# EAGLE design PDB (EAGLE 9.5.2)
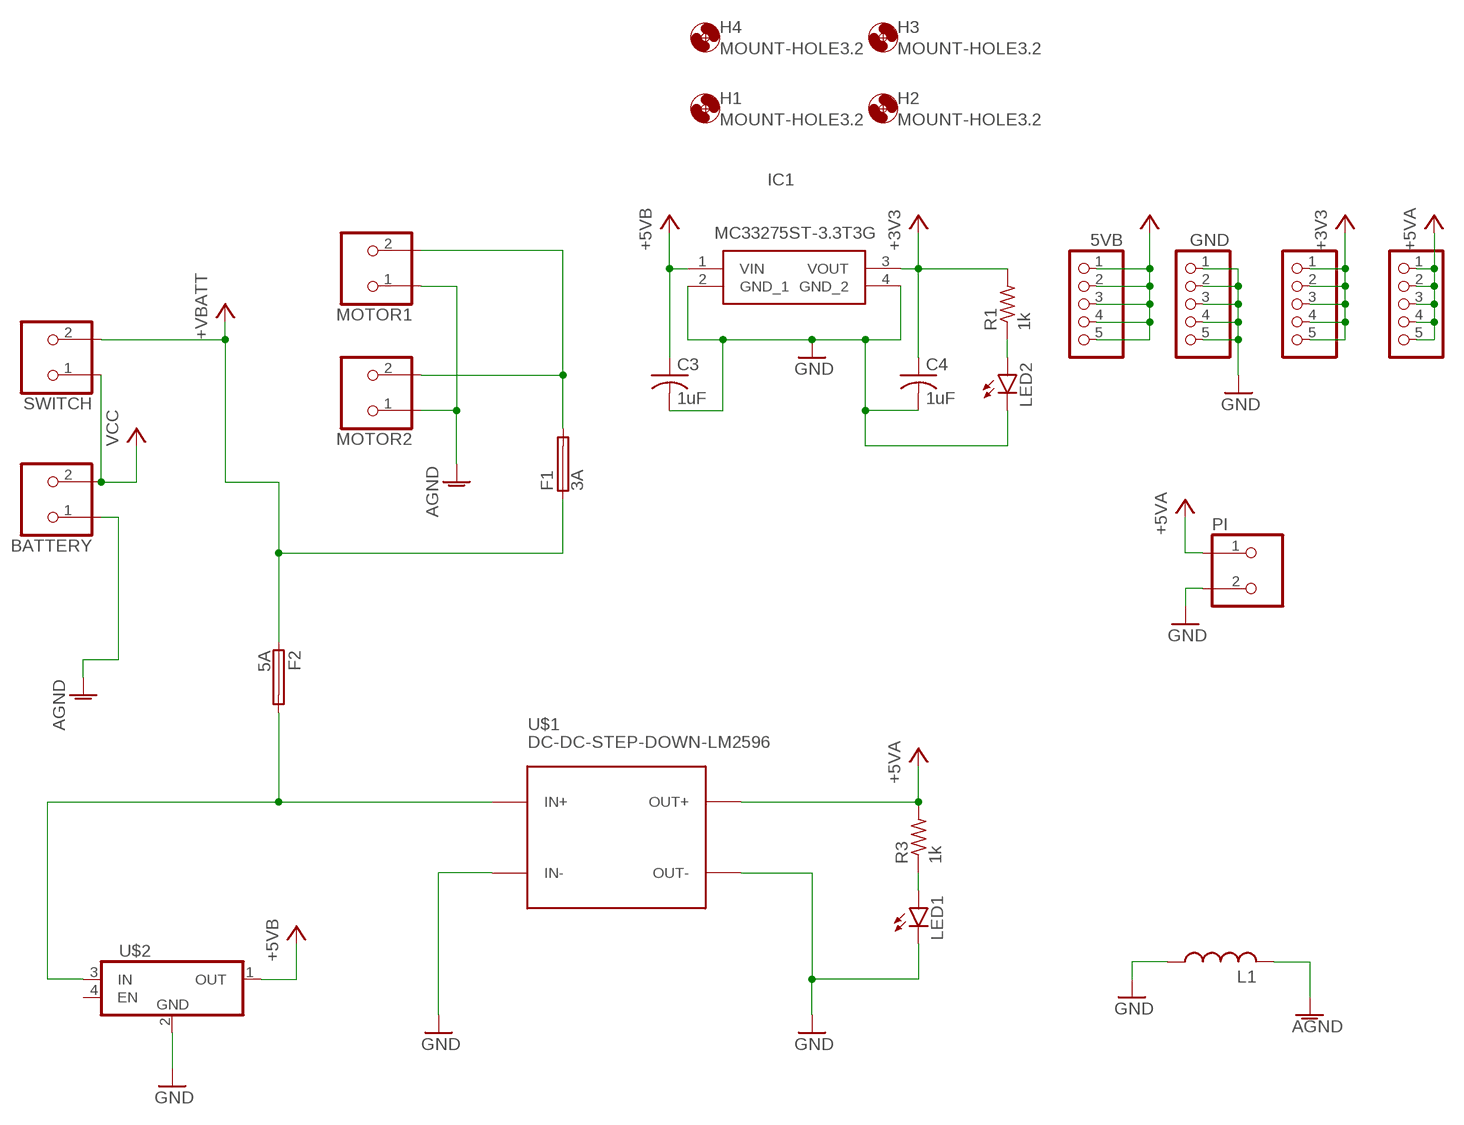
[diagram p0: schematic, sheet 1]

## Parts
3V3  PINHD-1X5  [1X05]
5VA  PINHD-1X5  [1X05]
5VB  PINHD-1X5  [1X05]
BATTERY  TERMINAL_2PINS  [TERMINAL_1X2]
C3  1uF  C-USC0805  [C0805]
C4  1uF  C-USC0805  [C0805]
F1  3A  SH22,5A  [SH22,5A]
F2  5A  SH22,5A  [SH22,5A]
GND  PINHD-1X5  [1X05]
H1  MOUNT-HOLE3.2  [3,2]
H2  MOUNT-HOLE3.2  [3,2]
H3  MOUNT-HOLE3.2  [3,2]
H4  MOUNT-HOLE3.2  [3,2]
IC1  MC33275ST-3.3T3G  [SOT230P700X175-4N]
L1  L-USL1812  [L1812]
LED1  LED5MM  [LED5MM]
LED2  LED5MM  [LED5MM]
MOTOR1  TERMINAL_2PINS  [TERMINAL_1X2]
MOTOR2  TERMINAL_2PINS  [TERMINAL_1X2]
PI  TERMINAL_2PINS  [TERMINAL_1X2]
R1  1k  R-US_R0805  [R0805]
R3  1k  R-US_R0805  [R0805]
SWITCH  TERMINAL_2PINS  [TERMINAL_1X2]
U$1  DC-DC-STEP-DOWN-LM2596  [DC-DC-STEP-DOWN-LM2596]
U$2  DC-DC-STEP-DOWN-MP2315  [DC-DC-STEP-DOWN-MP2315]

## Nets
+3V3: 3V3.1 3V3.2 3V3.3 3V3.4 3V3.5 C4.1 IC1.3(VOUT) R1.2
+5VA: 5VA.1 5VA.2 5VA.3 5VA.4 5VA.5 PI.1 R3.2 U$1.OUT+
+5VB: 5VB.1 5VB.2 5VB.3 5VB.4 5VB.5 C3.1 IC1.1(VIN) U$2.1(OUT)
+VBATT: F1.1 F2.1 SWITCH.2
AGND: BATTERY.1 L1.2 MOTOR1.1 MOTOR2.1
GND: C3.2 C4.2 GND.1 GND.2 GND.3 GND.4 GND.5 IC1.2(GND_1) IC1.4(GND_2) L1.1 LED1.K(C) LED2.K(C) PI.2 U$1.IN- U$1.OUT- U$2.2(GND)
N$5: F1.2 MOTOR1.2 MOTOR2.2
N$11: LED2.A R1.1
N$12: LED1.A R3.1
VCC: BATTERY.2 SWITCH.1
VFUSE1: F2.2 U$1.IN+ U$2.3(IN)
Unconnected: U$2.4(EN)

## Library data of the parts
3V3 5VA 5VB GND = pinhead:PINHD-1X5: PIN HEADER
BATTERY MOTOR1 MOTOR2 PI SWITCH = sep150:TERMINAL_2PINS
C3 C4 = rcl:C-US: CAPACITOR, American symbol; SPICEPREFIX: C
F1 F2 = sep150:SH22,5A: FUSE HOLDER grid 22,5mm, isolated cap OGN0031 8201, Schurter (Buerklin); MPN: 0031.7701.11; OC_FARNELL: unknown; OC_NEWARK: 04F1224
H1-H4 = holes:MOUNT-HOLE: MOUNTING HOLE with drill center marker
IC1 = MC33275ST-3.3T3G:MC33275ST-3.3T3G: LDO Regulator 3.3V 1% 300mA SOT223 ON Semiconductor MC33275ST-3.3T3G, LDO Voltage Regulator, 300mA, 3.3 V, Maximum of 13 Vin, 3 + Tab-Pin SOT-223 Source: Datasheet <https://componentsearchengine.com/Datasheets/1/MC33275ST-3.3T3G.pdf>; DESCRIPTION: LDO Regulator 3.3V 1% 300mA SOT223 ON Semiconductor MC33275ST-3.3T3G, LDO Voltage Regulator, 300mA, 3.3 V, Maximum of 13 Vin, 3 + Tab-Pin SOT-223; HEIGHT: 1.75mm; MANUFACTURER_NAME: ON Semiconductor; MANUFACTURER_PART_NUMBER: MC33275ST-3.3T3G; MOUSER_PART_NUMBER: 863-MC33275ST-3.3T3G; MOUSER_PRICE-STOCK: https://www.mouser.com/Search/Refine.aspx?Keyword=863-MC33275ST-3.3T3G
L1 = rcl:L-US: INDUCTOR, American symbol; SPICEPREFIX: L
LED1 LED2 = led:LED: LED OSRAM: - CHIPLED LG R971, LG N971, LY N971, LG Q971, LY Q971, LO R971, LY R971 LH N974, LH R974 LS Q976, LO Q976, LY Q976 LO Q996 - Hyper CHIPLED LW Q18S LB Q993, LB Q99A, LB R99A - SideLED LS A670, LO A670, LY A670, LG A670, LP A670 LB A673, LV A673, LT A673, LW A673 LH A674 LY A675 LS A676, LA A676, LO A676, LY A676, LW A676 LS A679, LY A679, LG A679 - Hyper Micro SIDELED® LS Y876, LA Y876, LO Y876, LY Y876 LT Y87S - SmartLED LW L88C, LW L88S LB L89C, LB L89S, LG L890 LS L89K, LO L89K, LY L89K LS L896, LA L896, LO L896, LY L896 - TOPLED LS T670, LO T670, LY T670, LG T670, LP T670 LSG T670, LSP T670, LSY T670, LOP T670, LYG T670 LG T671, LOG T671, LSG T671 LB T673, LV T673, LT T673, LW T673 LH T674 LS T676, LA T676, LO T676, LY T676, LB T676, LH T676, LSB T676, LW T676 LB T67C, LV T67C, LT T67C, LS T67K, LO T67K, LY T67K, LW E67C LS E67B, LA E67B, LO E67B, LY E67B, LB E67C, LV E67C, LT E67C LW T67C LS T679, LY T679, LG T679 LS T770, LO T770, LY T770, LG T770, LP T770 LB T773, LV T773, LT T773, LW T773 LH T774 LS E675, LA E675, LY E675, LS T675 LS T776, LA T776, LO T776, LY T776, LB T776 LHGB T686 LT T68C, LB T68C - Hyper Mini TOPLED® LB M676 - Mini TOPLED Santana® LG M470 LS M47K, LO M47K, LY M47K Source: http://www.osram.convergy.de LUXEON: - LUMILED® LXK2-PW12-R00, LXK2-PW12-S00, LXK2-PW14-U00, LXK2-PW14-V00 LXK2-PM12-R00, LXK2-PM12-S00, LXK2-PM14-U00 LXK2-PE12-Q00, LXK2-PE12-R00, LXK2-PE12-S00, LXK2-PE14-T00, LXK2-PE14-U00 LXK2-PB12-K00, LXK2-PB12-L00, LXK2-PB12-M00, LXK2-PB14-N00, LXK2-PB14-P00, LXK2-PB14-Q00 LXK2-PR12-L00, LXK2-PR12-M00, LXK2-PR14-Q00, LXK2-PR14-R00 LXK2-PD12-Q00, LXK2-PD12-R00, LXK2-PD12-S00 LXK2-PH12-R00, LXK2-PH12-S00 LXK2-PL12-P00, LXK2-PL12-Q00, LXK2-PL12-R00 Source: www.luxeon.com KINGBRIGHT: KA-3528ASYC Source: www.kingbright.com
R1 R3 = rcl:R-US_: RESISTOR, American symbol; SPICEPREFIX: R
U$1 = diy-modules:DC-DC-STEP-DOWN-LM2596: DC/DC Step-Down Regulator based on LM2596-ADJ chip LM2596 datasheet available here: http://www.ti.com/lit/ds/symlink/lm2596.pdf Click here to find device on ebay.com <http://www.ebay.com/sch/lm2596+power+regulator>
U$2 = sep150:DC-DC-STEP-DOWN-MP2315

## Board
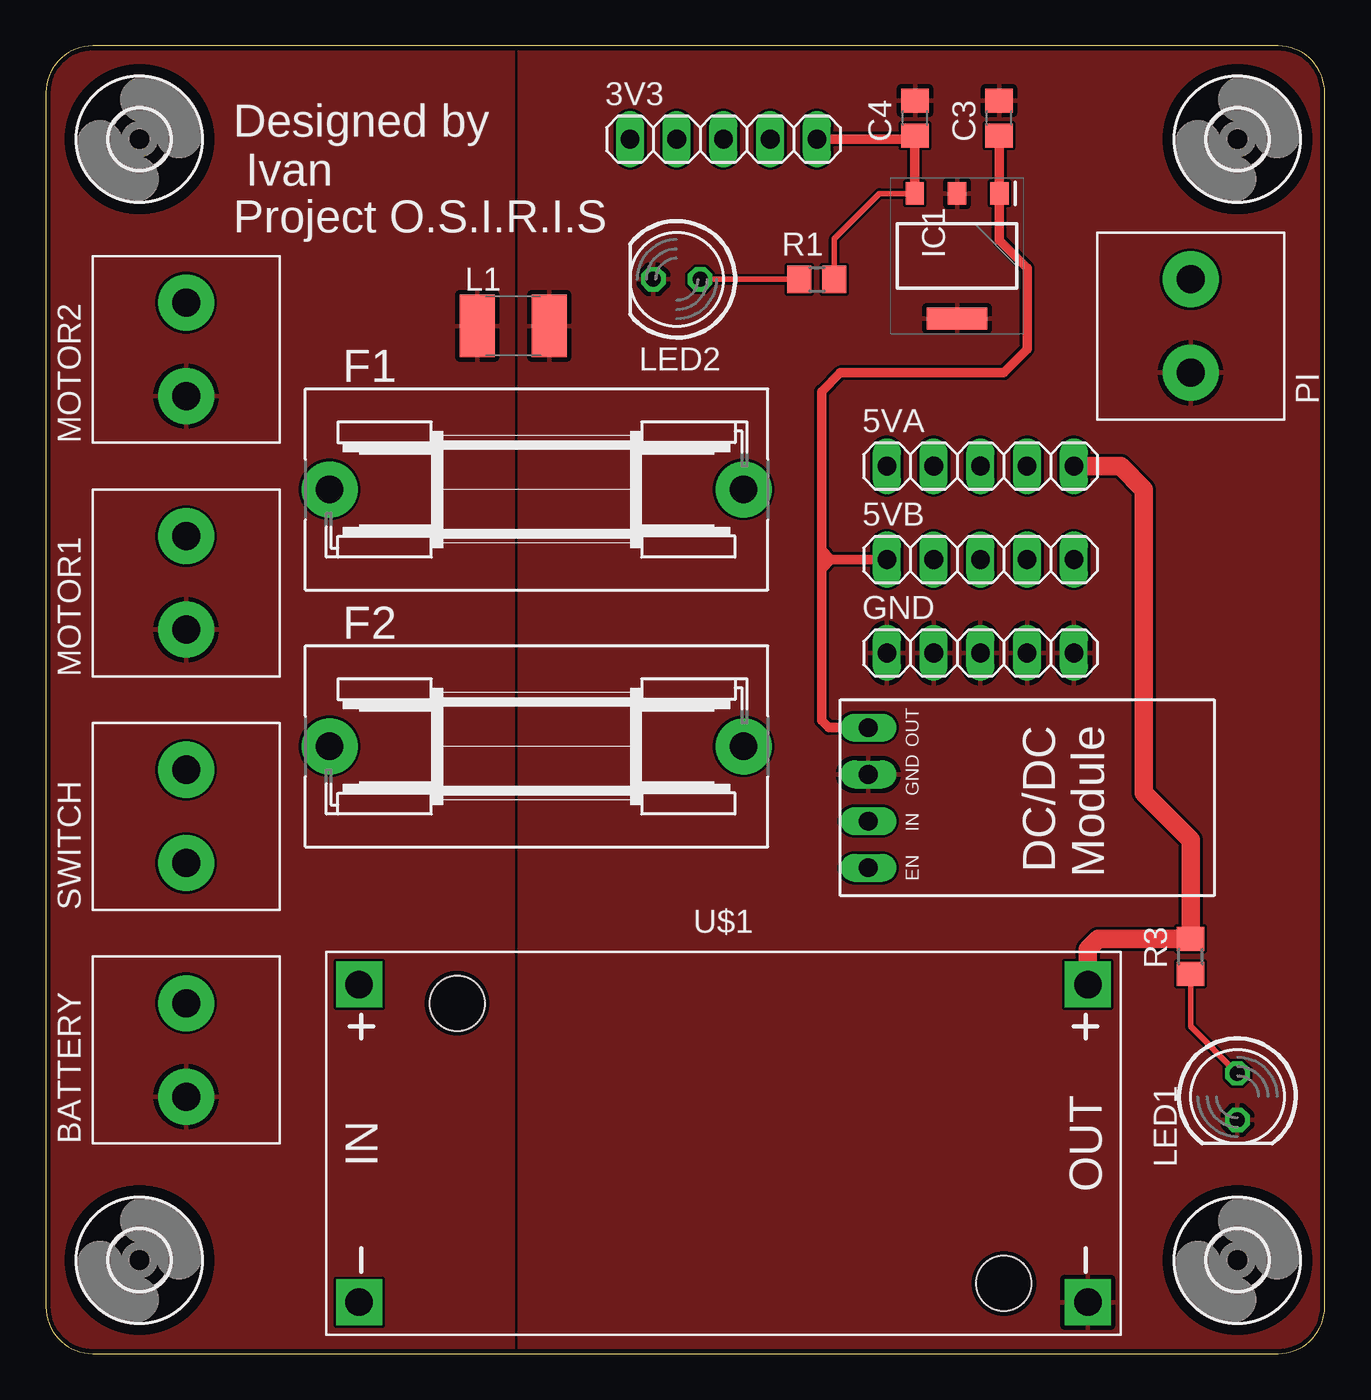
[diagram p1: board, top side]
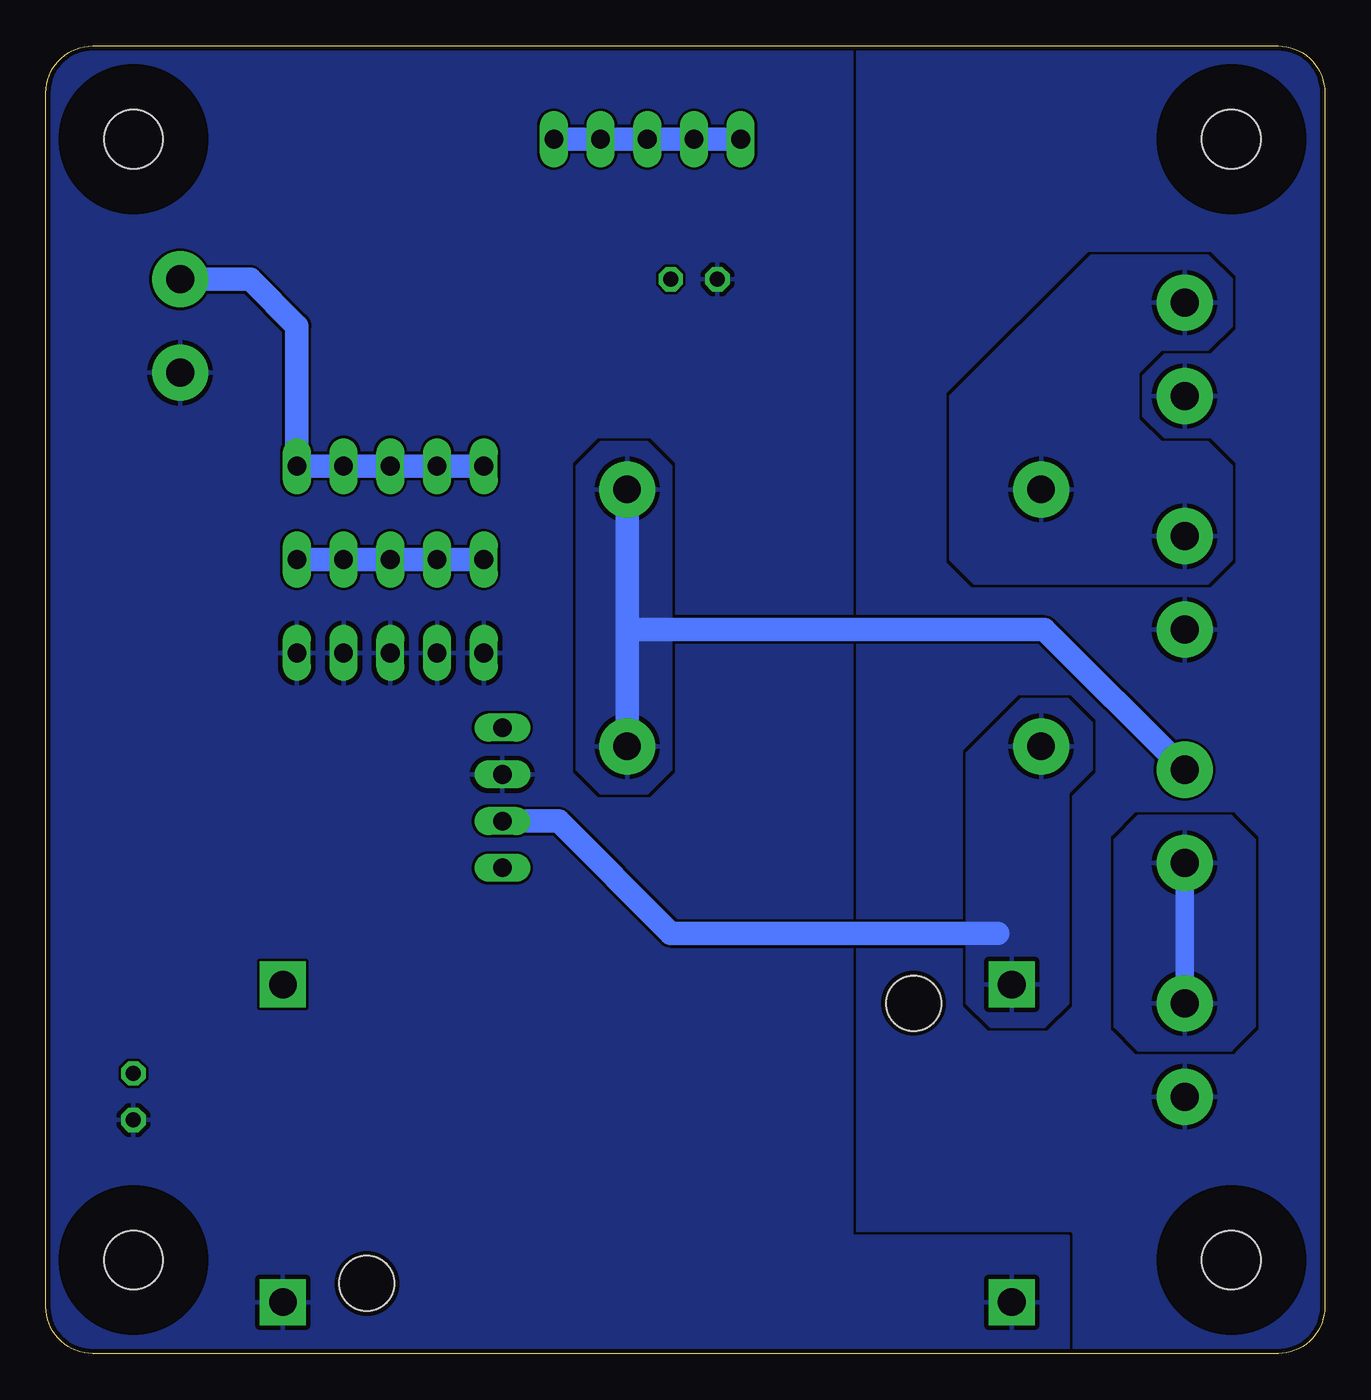
[diagram p2: board, bottom side, seen from below]

Size 69.52 x 71.11 mm. Coordinates in mm from the lower left corner, seen from the top.
Outline: 0,68.57 0,2.54 arc90 2.54,0 66.98,0 arc90 69.52,2.54 69.52,68.57 arc90 66.98,71.11 2.54,71.11 arc90 0,68.57
Copper layers (1*16): Top 0.035mm / dielectric 1.5mm / Bottom 0.035mm
Design rules "SeeedStudio_2layer_DRU_no_angle_20140221": minimum track width 6mil, minimum drill 12mil, track to track 6mil, track to pad 6mil, pad to pad 6mil, via to via 6mil, smd to smd 0mil, copper to edge 10mil, drill to drill 10mil, minimum pad ring 10mil, minimum via ring 6mil, stop-mask expansion 2mil, vias tented up to drill 100mil, thermal gap 10mil

### Footprints (pad centres in the part's own frame; a part is rotated, then mirrored left to right if it is on the bottom)
1X05 = drill 1.016 long: 1 -5.08,0; 2 -2.54,0; 3 0,0; 4 2.54,0; 5 5.08,0
TERMINAL_1X2 = drill 1.524 pad 3.048: 1 -6.35,-3.81; 2 -1.27,-3.81
C0805 = smd 1.3 x 1.5: 1 -0.95,0; 2 0.95,0
SH22,5A = drill 1.499 pad 3.048: 1 -11.252,0; 2 11.252,0
3,2 = hole 3.2: 0,0
SOT230P700X175-4N = smd 1.2 x 1: 1 -3.4,2.3; 2 -3.4,0; 3 -3.4,-2.3 | smd 1.2 x 3.3: 4 3.4,0
L1812 = smd 1.9 x 3.4: 1 -1.95,0; 2 1.95,0
LED5MM = drill 0.813 octagon: A -1.27,0; K 1.27,0
R0805 = smd 1.3 x 1.5: 1 -0.95,0; 2 0.95,0
DC-DC-STEP-DOWN-LM2596 = drill 1.5 pad 2.5 square: IN+ -19.812,8.636; IN- -19.812,-8.636; OUT+ 19.812,8.636; OUT- 19.812,-8.636 | hole 3: -14.478,7.62; 15.24,-7.62
DC-DC-STEP-DOWN-MP2315 = drill 1.016 long: 1 1.524,1.524; 2 4.064,1.524; 3 6.604,1.524; 4 9.144,1.524

### Placement (x,y rotation side)
3V3  36.83,66.04 0 top
5VA  50.8,48.26 0 top
5VB  50.8,43.18 0 top
BATTERY  3.81,20.32 90 top
C3  51.82,67.18 90 top
C4  47.24,67.18 90 top
F1  26.67,46.99 180 top
F2  26.67,33.02 180 top
GND  50.8,38.1 0 top
H1  5.08,5.08 0 top
H2  64.77,5.08 0 top
H3  5.08,66.04 0 top
H4  64.77,66.04 0 top
IC1  49.53,59.69 270 top
L1  25.4,55.88 180 top
LED1  64.77,13.97 270 top
LED2  34.29,58.42 180 top
MOTOR1  3.81,45.72 90 top
MOTOR2  3.81,58.42 90 top
PI  66.04,52.07 270 top
R1  41.91,58.42 0 top
R3  62.23,21.59 90 top
SWITCH  3.81,33.02 90 top
U$1  36.83,11.43 0 top
U$2  43.18,35.56 270 top

### Tracks (layer width: path | path; a pad name or v marks a point on that pad's centre or on a via)
+3V3
  Top 0.305: R1.2 42.86,60.64 45.31,63.09 IC1.3
  Top 0.508: 3V3.5 47.05,66.04 C4.1 47.23,66.22 IC1.3
  Bottom 1.27: 3V3.1 3V3.2 3V3.3 3V3.4 3V3.5
+5VA
  Top 1.016: 5VA.5 58.42,48.26 59.69,46.99 59.69,30.48 62.23,27.94 R3.2 57.21,22.54 56.64,21.97 U$1.OUT+
  Bottom 1.27: PI.1 58.42,58.42 55.88,55.88 5VA.5 5VA.4 5VA.3 5VA.2 5VA.1
+5VB
  Top 0.508: C3.1 51.83,66.22 IC1.1 51.83,60.55 53.34,59.04 53.34,54.61 52.07,53.34 43.18,53.34 42.16,52.32 42.16,43.69 | U$2.1 42.55,34.04 42.16,34.42 42.16,42.67 | 42.16,42.67 42.16,43.18 | 42.16,43.18 42.16,43.69 | 5VB.1 42.67,43.18 | 42.67,43.18 42.16,43.18 | 42.16,43.69 42.67,43.18 | 42.67,43.18 42.16,42.67
  Bottom 1.27: 5VB.1 5VB.2 5VB.3 5VB.4 5VB.5
+VBATT
  Bottom 1.27: F1.1 37.92,39.37 | 37.92,39.37 F2.1 | 37.92,39.37 15.24,39.37 SWITCH.2
  pour Bottom: 35.56,48.26 36.83,49.53 39.37,49.53 40.64,48.26 40.64,31.75 39.37,30.48 36.83,30.48 35.56,31.75
AGND
  pour Top (rank 5): 25.4,0 2.54,0 arc-90 0,2.54 0,68.58 arc-90 2.54,71.12 25.4,71.12
  pour Bottom (rank 5): 25.4,0 2.54,0 arc-90 0,2.54 0,68.58 arc-90 2.54,71.12 25.4,71.12
GND
  pour Bottom (rank 6): 0,2.54 0,68.58 arc-90 2.54,71.12 67.31,71.12 arc-90 69.85,68.58 69.85,2.54 arc-90 67.31,0 2.54,0 arc-90
  pour Top (rank 6): 67.31,0 2.54,0 arc-90 0,2.54 0,68.58 arc-90 2.54,71.12 67.31,71.12 arc-90 69.85,68.58 69.85,2.54 arc-90
  pour Bottom (rank 4): 13.97,6.35 26.67,6.35 26.67,0 13.97,0
N$5
  pour Bottom: 5.08,55.88 5.08,58.42 6.35,59.69 12.7,59.69 20.32,52.07 20.32,43.18 19.05,41.91 6.35,41.91 5.08,43.18 5.08,48.26 6.35,49.53 8.89,49.53 10.16,50.8 10.16,53.34 8.89,54.61 6.35,54.61
N$11
  Top 0.305: LED2.A R1.1
N$12
  Top 0.305: LED1.A 62.23,17.78 R3.1
VCC
  Bottom 1.016: SWITCH.1 BATTERY.2
  pour Bottom: 11.43,27.94 11.43,17.78 10.16,16.51 5.08,16.51 3.81,17.78 3.81,27.94 5.08,29.21 10.16,29.21
VFUSE1
  Bottom 1.27: 17.78,22.86 35.56,22.86 41.66,28.96 U$2.3
  pour Bottom: 19.43,32.64 19.43,19.05 18.16,17.78 15.24,17.78 13.97,19.05 13.97,30.48 12.7,31.75 12.7,34.29 13.97,35.56 16.51,35.56

### Text on the board
tNames: Designed by / Ivan | Project O.S.I.R.I.S